# Altium project ACTIVIEW-ELECTRODE-PCB.PrjPcb
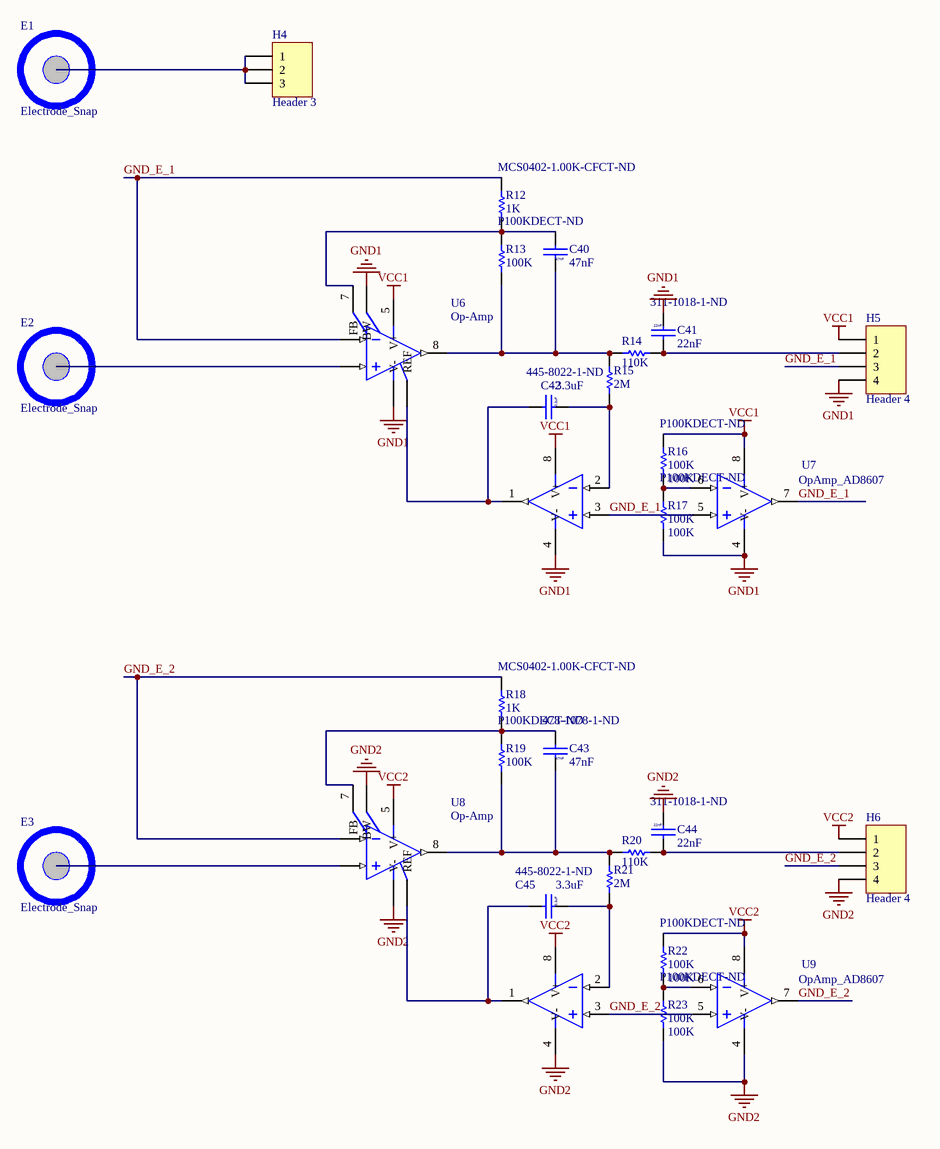
[diagram p0: Active_Electrode.SchDoc]
1 sheet, 28 parts. Net scope: global (net labels, ports and power ports of the same name join across sheets).

## Sheet Active_Electrode.SchDoc
size 381 x 381 mm

### Parts
C40  47nF  [0402[IMP]]
C41  22nF  Supplier Part Number 1: 311-1018-1-ND  [0402[IMP]]
C42  3.3uF  Supplier Part Number 1: 445-8022-1-ND  [0402[IMP]]
C43  47nF  Supplier Part Number 1: 478-1078-1-ND  [0402[IMP]]
C44  22nF  Supplier Part Number 1: 311-1018-1-ND  [0402[IMP]]
C45  3.3uF  Supplier Part Number 1: 445-8022-1-ND  [0402[IMP]]
E1  Electrode_Snap  [Electrode_Socket]
E2  Electrode_Snap  [Electrode_Socket]
E3  Electrode_Snap  [Electrode_Socket]
H4  Header 3  [Header 3  -MolexPicoBlade - RightAngle]
H5  Header 4  [Header 4  -MolexPicoBlade - RightAngle]
H6  Header 4  [Header 4  -MolexPicoBlade - RightAngle]
R12  1K  Supplier Part Number 1: MCS0402-1.00K-CFCT-ND  [0402[IMP]]
R13  100K  Supplier Part Number 1: P100KDECT-ND  [0402[IMP]]
R14  110K  [0402[IMP]]
R15  2M  [0402[IMP]]
R16  100K  Supplier Part Number 1: P100KDECT-ND  [0402[IMP]]
R17  100K  Supplier Part Number 1: P100KDECT-ND  [0402[IMP]]
R18  1K  Supplier Part Number 1: MCS0402-1.00K-CFCT-ND  [0402[IMP]]
R19  100K  Supplier Part Number 1: P100KDECT-ND  [0402[IMP]]
R20  110K  [0402[IMP]]
R21  2M  [0402[IMP]]
R22  100K  Supplier Part Number 1: P100KDECT-ND  [0402[IMP]]
R23  100K  Supplier Part Number 1: P100KDECT-ND  [0402[IMP]]
U6  Op-Amp  [MSOP-8]
U7  OpAmp_AD8607  [MSOP-8]
U8  Op-Amp  [MSOP-8]
U9  OpAmp_AD8607  [MSOP-8]

### Nets
GND1: C41.2 H5.4 R17.1 U6.1(BW) U6.4(V-) U7.4(V-)
GND2: C44.2 H6.4 R23.1 U8.1(BW) U8.4(V-) U9.4(V-)
VCC1: H5.1 R16.2 U6.5(V+) U7.8(V+)
VCC2: H6.1 R22.2 U8.5(V+) U9.8(V+)
GND_E_1: H5.3 R12.2 U6.3(-IN) U7.3(+IN) U7.5(+IN) U7.7(OUT)
GND_E_2: H6.3 R18.2 U8.3(-IN) U9.3(+IN) U9.5(+IN) U9.7(OUT)
NetC40_1: C40.1 R12.1 R13.2 U6.7(FB)
NetC40_2: C40.2 R13.1 R14.1 R15.2 U6.8(OUT)
NetC41_1: C41.1 H5.2 R14.2
NetC42_1: C42.1 U6.6(REF) U7.1(OUT)
NetC42_2: C42.2 R15.1 U7.2(-IN)
NetC43_1: C43.1 R18.1 R19.2 U8.7(FB)
NetC43_2: C43.2 R19.1 R20.1 R21.2 U8.8(OUT)
NetC44_1: C44.1 H6.2 R20.2
NetC45_1: C45.1 U8.6(REF) U9.1(OUT)
NetC45_2: C45.2 R21.1 U9.2(-IN)
NetE1_1: E1.1(Signal) H4.1 H4.2 H4.3
NetE2_1: E2.1(Signal) U6.2(+IN)
NetE3_1: E3.1(Signal) U8.2(+IN)
NetR16_1: R16.1 R17.2 U7.6(-IN)
NetR22_1: R22.1 R23.2 U9.6(-IN)

### Library data of the parts
C40-C45 = CAPACITOR: VOLTAGE: CMAX; CURRENT: CIMAX; KNEE: CBMAX; PSpiceTemplate: C^@REFDES %1 %2 ?TOLERANCE|C^@REFDES| @VALUE ?IC/IC=@IC/ TC=@TC1,@TC2 ?TOLERANCE|\n.model C^@REFDES CAP C=1 DEV=@TOLERANCE%|; DIST: FLAT; SLOPE: CSMAX; MAX_TEMP: CTMAX; TC1: 0; CLASS: DISCRETE; TC2: 0; Supplier 1: Digi-Key
  C40: Value: 47nF; Supplier Part Number 1: 478-1078-1-ND
  C41 C44: Value: 22nF
  C42 C45: Value: 3.3uF
  C43: Value: 47nF
R12-R23 = RESISTOR: Supplier 1: Digi-Key
  R12 R18: Value: 1K
  R13 R16 R17 R19 R22 R23: Value: 100K
  R14 R20: Value: 110K; Supplier Part Number 1: A103789CT-ND
  R15 R21: Value: 2M; Supplier Part Number 1: YAG3295CT-ND
U6 U8 = OpAmp_AD8237: Supplier 1: Digi-Key; Supplier Part Number 1: AD8237ARMZ-ND
H4 = Header 3: Supplier 1: Digi-Key; Supplier Part Number 1: WM7621CT-ND
H5 H6 = Header 4: Supplier 1: Digi-Key; Supplier Part Number 1: WM7622CT-ND
U7 U9 = OpAmp_AD8607: Supplier 1: Digi-Key; Supplier Part Number 1: AD8607ARMZ-ND